# EAGLE schematic Power (EAGLE 6.5.0)
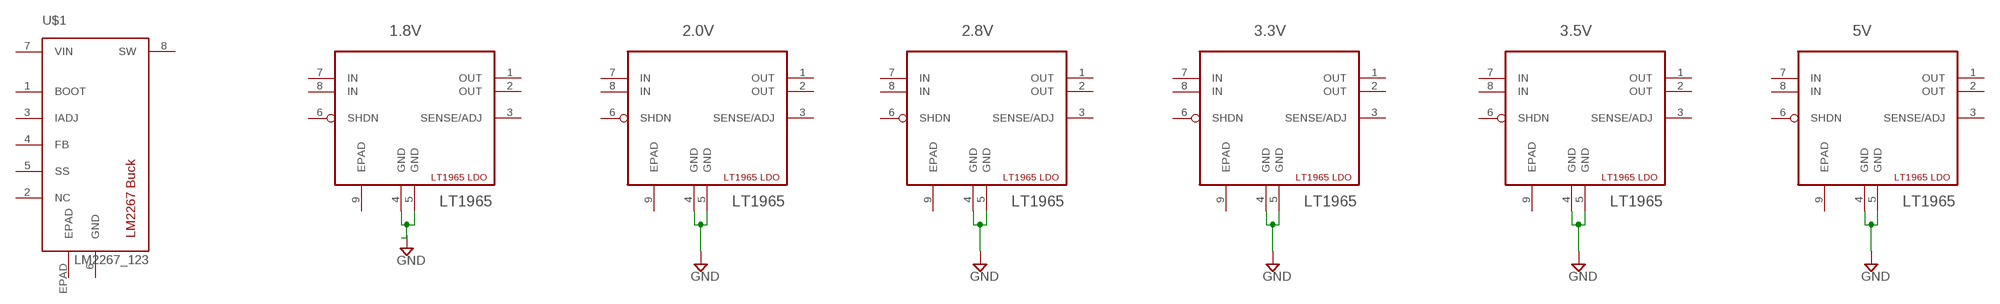
[diagram p0: schematic, sheet 1]

## Parts
1.8V  LT1965  [DFN3X3_8LEAD]
2.0V  LT1965  [DFN3X3_8LEAD]
2.8V  LT1965  [DFN3X3_8LEAD]
3.3V  LT1965  [DFN3X3_8LEAD]
3.5V  LT1965  [DFN3X3_8LEAD]
5V  LT1965  [DFN3X3_8LEAD]
U$1  LM2267_123  [DDA0008B]

## Nets
GND: 2.0V.4(GND) 2.0V.5(GND) 2.8V.4(GND) 2.8V.5(GND) 3.3V.4(GND) 3.3V.5(GND) 3.5V.4(GND) 3.5V.5(GND) 5V.4(GND) 5V.5(GND)
N$1: 1.8V.4(GND) 1.8V.5(GND)
Unconnected: 1.8V.3(SENSE/ADJ) 1.8V.6(SHDN) 2.0V.3(SENSE/ADJ) 2.0V.6(SHDN) 2.8V.3(SENSE/ADJ) 2.8V.6(SHDN) 3.3V.3(SENSE/ADJ) 3.3V.6(SHDN) 3.5V.3(SENSE/ADJ) 3.5V.6(SHDN) 5V.3(SENSE/ADJ) 5V.6(SHDN) U$1.2(NC) U$1.3(IADJ) U$1.4(FB) U$1.5(SS)

## Power pins joined to a net without a drawn wire
BOOT: U$1.1(BOOT)
EPAD: 1.8V.9(EPAD) 2.0V.9(EPAD) 2.8V.9(EPAD) 3.3V.9(EPAD) 3.5V.9(EPAD) 5V.9(EPAD) U$1.EPAD
GND: U$1.6(GND)
IN: 1.8V.7(IN) 1.8V.8(IN) 2.0V.7(IN) 2.0V.8(IN) 2.8V.7(IN) 2.8V.8(IN) 3.3V.7(IN) 3.3V.8(IN) 3.5V.7(IN) 3.5V.8(IN) 5V.7(IN) 5V.8(IN)
OUT: 1.8V.1(OUT) 1.8V.2(OUT) 2.0V.1(OUT) 2.0V.2(OUT) 2.8V.1(OUT) 2.8V.2(OUT) 3.3V.1(OUT) 3.3V.2(OUT) 3.5V.1(OUT) 3.5V.2(OUT) 5V.1(OUT) 5V.2(OUT)
SW: U$1.8(SW)
VIN: U$1.7(VIN)

## Library data of the parts
1.8V 2.0V 2.8V 3.3V 3.5V 5V = LT1965_LDO:LT1965: Low Dropout Regulator; PACKAGE: DFN-8; SUPPLIER: Linear Technology
U$1 = LM2267_123:LM2267_123: LM2267x X may be either the 1, 2, or 3 versions.